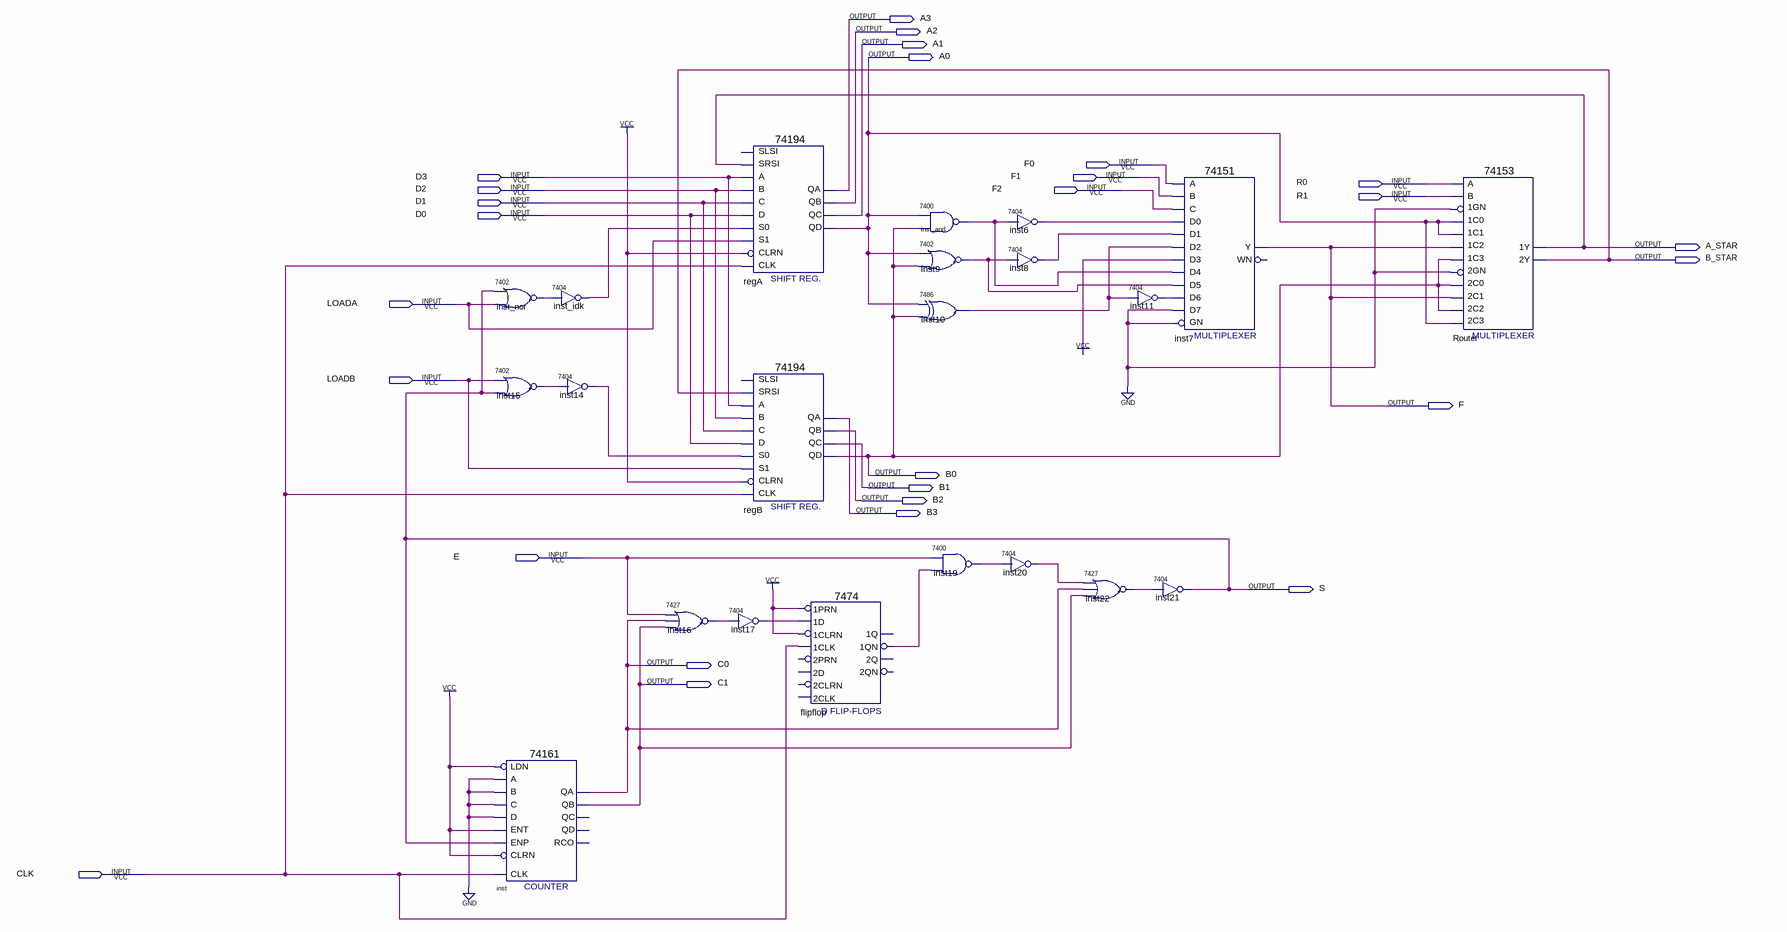
[diagram p0: schematic sheet]
// Quartus schematic lab1.bdf as structural Verilog: 22 symbols, 27 pins
module lab1 (
  input  F0,
  input  D3,
  input  F1,
  input  R0,
  input  D2,
  input  F2,
  input  R1,
  input  D1,
  input  D0,
  input  LOADA,
  input  LOADB,
  input  E,
  input  CLK,
  output A3,
  output A2,
  output A1,
  output A0,
  output A_STAR,
  output B_STAR,
  output F,
  output B0,
  output B1,
  output B2,
  output B3,
  output S,
  output C0,
  output C1
);

  wire flipflop_1qn, inst6_1, inst8_1, inst9_1, inst10_1, inst11_1, inst14_1, inst15_1, inst16_1, inst17_1,
       inst19_1, inst20_1, inst22_1, inst_and_1, inst_idk_1, inst_nor_1;

  \7402  inst_nor (.\2 (S), .\3 (LOADA), .\1 (inst_nor_1));
  \7402  inst15 (.\2 (LOADB), .\3 (S), .\1 (inst15_1));
  \74161  inst (
    .CLRN(1'b1), .CLK(CLK), .ENP(S), .LDN(1'b1), .A(1'b0), .D(1'b0), .ENT(1'b1), .B(1'b0), .C(1'b0), .QB(C1),
    .QA(C0));  // open: QD, QC, RCO
  \7404  inst_idk (.\2 (inst_nor_1), .\1 (inst_idk_1));
  \7404  inst14 (.\2 (inst15_1), .\1 (inst14_1));
  \7427  inst16 (.\4 (C1), .\3 (C0), .\2 (E), .\1 (inst16_1));
  \74194  regA (
    .SRSI(A_STAR), .B(D2), .C(D1), .CLK(CLK), .CLRN(1'b1), .D(D0), .S1(LOADA), .S0(inst_idk_1), .A(D3),
    .QA(A3), .QB(A2), .QC(A1), .QD(A0));  // open: SLSI
  \74194  regB (
    .SRSI(B_STAR), .B(D2), .C(D1), .CLK(CLK), .CLRN(1'b1), .D(D0), .S1(LOADB), .S0(inst14_1), .A(D3),
    .QA(B3), .QB(B2), .QC(B1), .QD(B0));  // open: SLSI
  \7404  inst17 (.\2 (inst16_1), .\1 (inst17_1));
  \7474  flipflop (
    .\1CLK (CLK), .\1D (inst17_1), .\1PRN (1'b1), .\1CLRN (1'b1), .\1QN (flipflop_1qn));  // open: 2D, 2PRN, 2CLK, 2CLRN, 2Q, 2QN, 1Q
  \7400  inst_and (.\3 (B0), .\2 (A0), .\1 (inst_and_1));
  \7402  inst9 (.\2 (A0), .\3 (B0), .\1 (inst9_1));
  \7486  inst10 (.\2 (A0), .\3 (B0), .\1 (inst10_1));
  \7400  inst19 (.\3 (flipflop_1qn), .\2 (E), .\1 (inst19_1));
  \7404  inst6 (.\2 (inst_and_1), .\1 (inst6_1));
  \7404  inst8 (.\2 (inst9_1), .\1 (inst8_1));
  \7404  inst20 (.\2 (inst19_1), .\1 (inst20_1));
  \7427  inst22 (.\4 (C1), .\3 (C0), .\2 (inst20_1), .\1 (inst22_1));
  \7404  inst11 (.\2 (inst10_1), .\1 (inst11_1));
  \7404  inst21 (.\2 (inst22_1), .\1 (S));
  \74151  inst7 (
    .GN(1'b0), .C(F2), .B(F1), .A(F0), .D5(inst9_1), .D0(inst6_1), .D1(inst8_1), .D4(inst_and_1), .D3(1'b1),
    .D2(inst10_1), .D6(inst11_1), .D7(1'b0), .Y(F));  // open: WN
  \74153  Router (
    .\1C1 (A0), .\1GN (1'b0), .\1C0 (A0), .\2C0 (B0), .\2GN (1'b0), .\2C2 (B0), .\1C2 (F), .\1C3 (B0),
    .B(R1), .A(R0), .\2C1 (F), .\2C3 (A0), .\1Y (A_STAR), .\2Y (B_STAR));
endmodule
